# Altium schematic sheet stm32f407pin.SchDoc
size A4
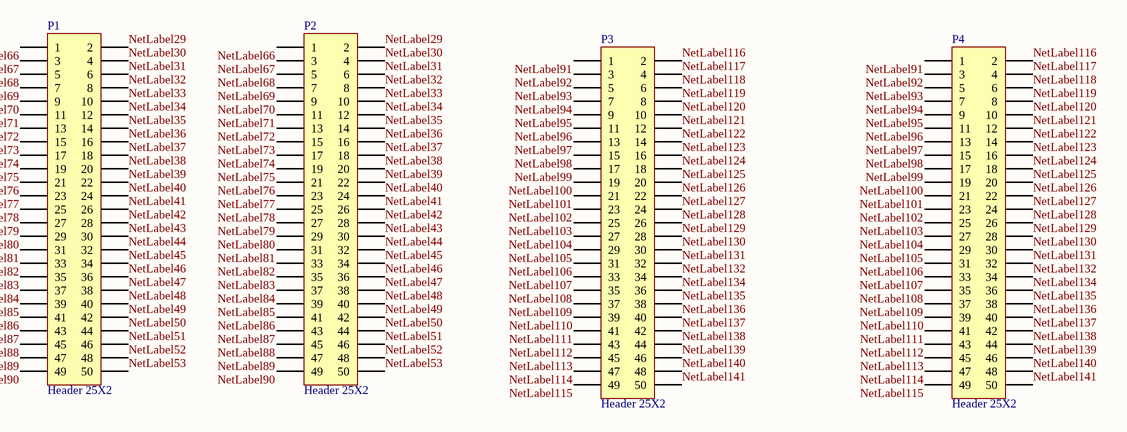
[diagram p0: stm32f407pin.SchDoc]

## Parts
P1  Header 25X2  [HDR2X25]
P2  Header 25X2  [HDR2X25]
P3  Header 25X2  [HDR2X25]
P4  Header 25X2  [HDR2X25]

## Nets
NetLabel29: P1.2 P2.2
NetLabel30: P1.4 P2.4
NetLabel31: P1.6 P2.6
NetLabel32: P1.8 P2.8
NetLabel33: P1.10 P2.10
NetLabel34: P1.12 P2.12
NetLabel35: P1.14 P2.14
NetLabel36: P1.16 P2.16
NetLabel37: P1.18 P2.18
NetLabel38: P1.20 P2.20
NetLabel39: P1.22 P2.22
NetLabel40: P1.24 P2.24
NetLabel41: P1.26 P2.26
NetLabel42: P1.28 P2.28
NetLabel43: P1.30 P2.30
NetLabel44: P1.32 P2.32
NetLabel45: P1.34 P2.34
NetLabel46: P1.36 P2.36
NetLabel47: P1.38 P2.38
NetLabel48: P1.40 P2.40
NetLabel49: P1.42 P2.42
NetLabel50: P1.44 P2.44
NetLabel51: P1.46 P2.46
NetLabel52: P1.48 P2.48
NetLabel53: P1.50 P2.50
NetLabel66: P1.1 P2.1
NetLabel67: P1.3 P2.3
NetLabel68: P1.5 P2.5
NetLabel69: P1.7 P2.7
NetLabel70: P1.9 P2.9
NetLabel71: P1.11 P2.11
NetLabel72: P1.13 P2.13
NetLabel73: P1.15 P2.15
NetLabel74: P1.17 P2.17
NetLabel75: P1.19 P2.19
NetLabel76: P1.21 P2.21
NetLabel77: P1.23 P2.23
NetLabel78: P1.25 P2.25
NetLabel79: P1.27 P2.27
NetLabel80: P1.29 P2.29
NetLabel81: P1.31 P2.31
NetLabel82: P1.33 P2.33
NetLabel83: P1.35 P2.35
NetLabel84: P1.37 P2.37
NetLabel85: P1.39 P2.39
NetLabel86: P1.41 P2.41
NetLabel87: P1.43 P2.43
NetLabel88: P1.45 P2.45
NetLabel89: P1.47 P2.47
NetLabel90: P1.49 P2.49
NetLabel91: P3.1 P4.1
NetLabel92: P3.3 P4.3
NetLabel93: P3.5 P4.5
NetLabel94: P3.7 P4.7
NetLabel95: P3.9 P4.9
NetLabel96: P3.11 P4.11
NetLabel97: P3.13 P4.13
NetLabel98: P3.15 P4.15
NetLabel99: P3.17 P4.17
NetLabel100: P3.19 P4.19
NetLabel101: P3.21 P4.21
NetLabel102: P3.23 P4.23
NetLabel103: P3.25 P4.25
NetLabel104: P3.27 P4.27
NetLabel105: P3.29 P4.29
NetLabel106: P3.31 P4.31
NetLabel107: P3.33 P4.33
NetLabel108: P3.35 P4.35
NetLabel109: P3.37 P4.37
NetLabel110: P3.39 P4.39
NetLabel111: P3.41 P4.41
NetLabel112: P3.43 P4.43
NetLabel113: P3.45 P4.45
NetLabel114: P3.47 P4.47
NetLabel115: P3.49 P4.49
NetLabel116: P3.2 P4.2
NetLabel117: P3.4 P4.4
NetLabel118: P3.6 P4.6
NetLabel119: P3.8 P4.8
NetLabel120: P3.10 P4.10
NetLabel121: P3.12 P4.12
NetLabel122: P3.14 P4.14
NetLabel123: P3.16 P4.16
NetLabel124: P3.18 P4.18
NetLabel125: P3.20 P4.20
NetLabel126: P3.22 P4.22
NetLabel127: P3.24 P4.24
NetLabel128: P3.26 P4.26
NetLabel129: P3.28 P4.28
NetLabel130: P3.30 P4.30
NetLabel131: P3.32 P4.32
NetLabel132: P3.34 P4.34
NetLabel134: P3.36 P4.36
NetLabel135: P3.38 P4.38
NetLabel136: P3.40 P4.40
NetLabel137: P3.42 P4.42
NetLabel138: P3.44 P4.44
NetLabel139: P3.46 P4.46
NetLabel140: P3.48 P4.48
NetLabel141: P3.50 P4.50

## Library data of the parts
P1-P4 = Header 25X2: Header, 25-Pin, Dual row; LatestRevisionDate: 17-Jul-2002; LatestRevisionNote: Re-released for DXP Platform.; Publisher: Altium Limited